# EAGLE schematic Servo_update (EAGLE 9.6.2)
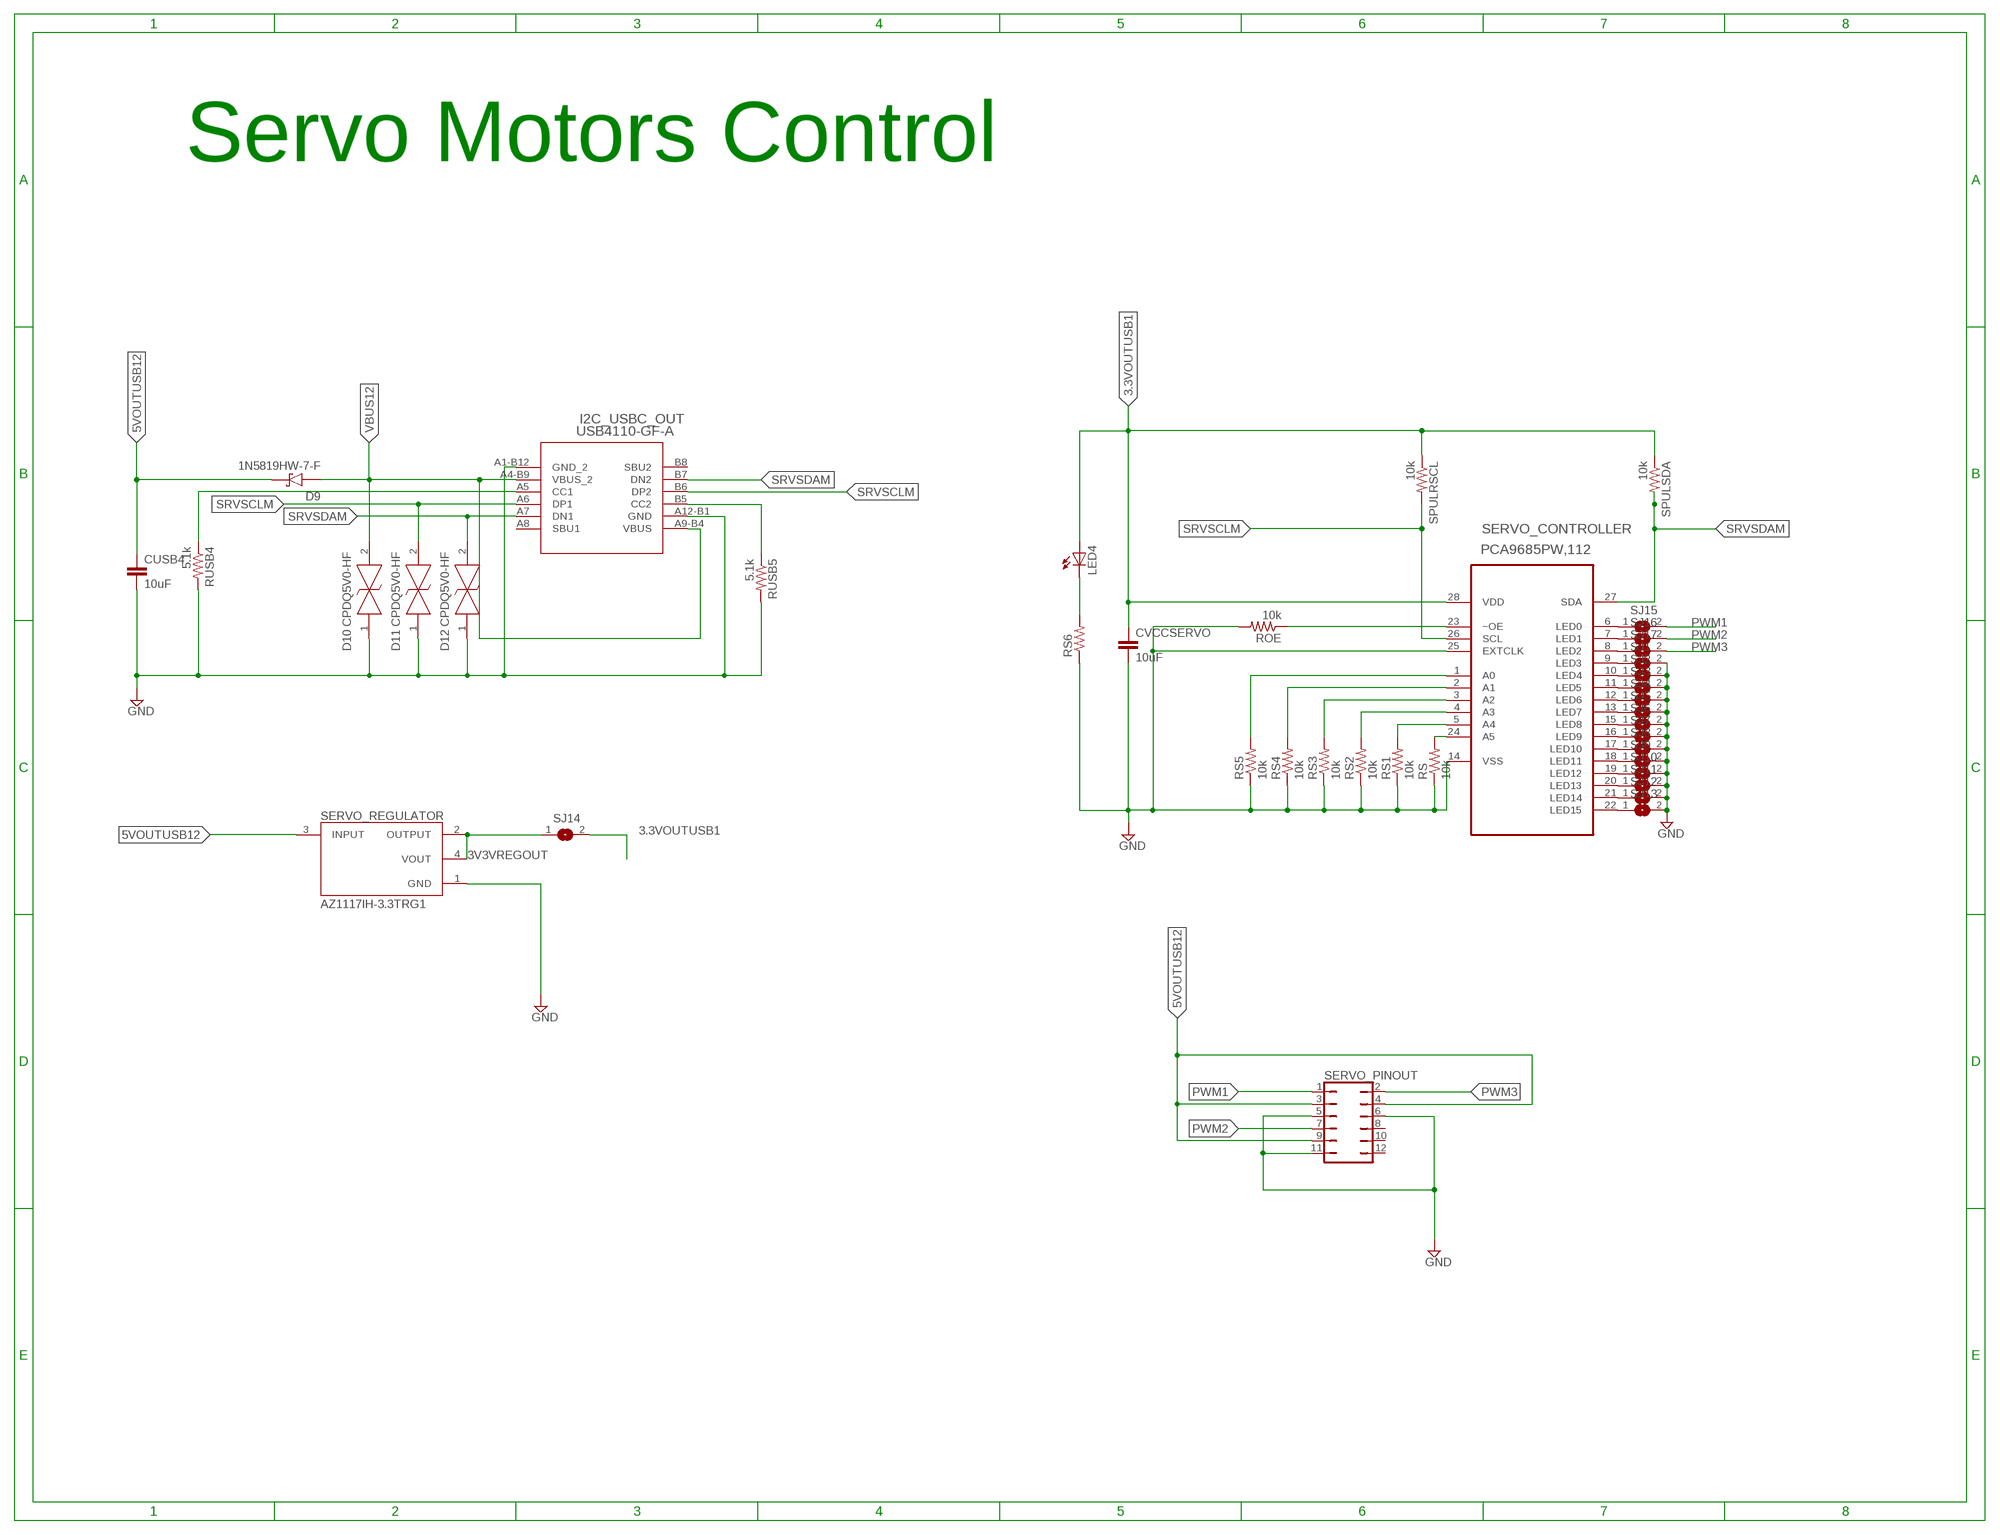
[diagram p0: schematic, sheet 1]

## Parts
CUSB4  10uF  C-EUC0805  [C0805]
CVCCSERVO  10uF  C-EUC0805  [C0805]
D9  1N5819HW-7-F  [SOD3715X145N]
D10  CPDQ5V0-HF  [MBTB-D-SOD-923F-IMP-0402]
D11  CPDQ5V0-HF  [MBTB-D-SOD-923F-IMP-0402]
D12  CPDQ5V0-HF  [MBTB-D-SOD-923F-IMP-0402]
I2C_USBC_OUT  USB4110-GF-A  [USB4110-GF-A_GCT]
LED4  LED  [SMARTLED-TTW]
ROE  10k  R-US_M0805  [M0805]
RS  10k  R-US_R0805  [R0805]
RS1  10k  R-US_R0805  [R0805]
RS2  10k  R-US_R0805  [R0805]
RS3  10k  R-US_R0805  [R0805]
RS4  10k  R-US_R0805  [R0805]
RS5  10k  R-US_R0805  [R0805]
RS6  2.2k  R-US_R0805  [R0805]
RUSB4  5.1k  R-US_M0805  [M0805]
RUSB5  5.1k  R-US_M0805  [M0805]
SERVO_CONTROLLER  PCA9685PW,112  [SOP65P640X110-28N]
SERVO_PINOUT  JP6Q  [JP6Q]
SERVO_REGULATOR  AZ1117IH-3.3TRG1  [SOT230P700X185-4N]
SJ1  SJ  [SJ]
SJ2  SJ  [SJ]
SJ3  SJ  [SJ]
SJ4  SJ  [SJ]
SJ5  SJ  [SJ]
SJ6  SJ  [SJ]
SJ7  SJ  [SJ]
SJ8  SJ  [SJ]
SJ9  SJ  [SJ]
SJ10  SJ  [SJ]
SJ11  SJ  [SJ]
SJ12  SJ  [SJ]
SJ13  SJ  [SJ]
SJ14  SJ  [SJ]
SJ15  SJ  [SJ]
SJ16  SJ  [SJ]
SJ17  SJ  [SJ]
SPULRSCL  10k  R-US_M0805  [M0805]
SPULSDA  10k  R-US_M0805  [M0805]

## Nets
3.3VOUTUSB1: CVCCSERVO.1 LED4.A@1(A) SERVO_CONTROLLER.28(VDD) SJ14.2 SPULRSCL.1 SPULSDA.1
3V3VREGOUT: SERVO_REGULATOR.2(OUTPUT) SERVO_REGULATOR.4(VOUT) SJ14.1
5VOUTUSB12: CUSB4.1 D9.C(K) SERVO_PINOUT.3 SERVO_PINOUT.4 SERVO_PINOUT.9 SERVO_REGULATOR.3(INPUT)
A0: RS5.2 SERVO_CONTROLLER.1(A0)
A1: RS4.2 SERVO_CONTROLLER.2(A1)
A2: RS3.2 SERVO_CONTROLLER.3(A2)
A3: RS2.2 SERVO_CONTROLLER.4(A3)
A4: RS1.2 SERVO_CONTROLLER.5(A4)
A5: RS.2 SERVO_CONTROLLER.24(A5)
CC1_RUSB4: I2C_USBC_OUT.A5(CC1) RUSB4.1
CC2: I2C_USBC_OUT.B5(CC2) RUSB5.1
GND: CUSB4.2 CVCCSERVO.2 D10.1(K) D11.1(K) D12.1(K) I2C_USBC_OUT.A1-B12(GND_2) I2C_USBC_OUT.A12-B1(GND) ROE.2 RS1.1 RS2.1 RS3.1 RS4.1 RS5.1 RS6.1 RS.1 RUSB4.2 RUSB5.2 SERVO_CONTROLLER.14(VSS) SERVO_CONTROLLER.25(EXTCLK) SERVO_PINOUT.5 SERVO_PINOUT.6 SERVO_PINOUT.11 SERVO_REGULATOR.1(GND) SJ1.2 SJ2.2 SJ3.2 SJ4.2 SJ5.2 SJ6.2 SJ7.2 SJ8.2 SJ9.2 SJ10.2 SJ11.2 SJ12.2 SJ13.2
LED_RS6: LED4.C@1(C) RS6.2
N$1: SERVO_CONTROLLER.9(LED3) SJ1.1
N$2: SERVO_CONTROLLER.10(LED4) SJ2.1
N$3: SERVO_CONTROLLER.11(LED5) SJ3.1
N$4: SERVO_CONTROLLER.12(LED6) SJ4.1
N$5: SERVO_CONTROLLER.13(LED7) SJ5.1
N$6: SERVO_CONTROLLER.15(LED8) SJ6.1
N$7: SERVO_CONTROLLER.16(LED9) SJ7.1
N$8: SERVO_CONTROLLER.18(LED11) SJ9.1
N$9: SERVO_CONTROLLER.19(LED12) SJ10.1
N$10: SERVO_CONTROLLER.20(LED13) SJ11.1
N$11: SERVO_CONTROLLER.21(LED14) SJ12.1
N$12: SERVO_CONTROLLER.17(LED10) SJ8.1
N$13: SERVO_CONTROLLER.22(LED15) SJ13.1
N$14: SERVO_CONTROLLER.6(LED0) SJ15.1
N$15: SERVO_CONTROLLER.7(LED1) SJ16.1
N$16: SERVO_CONTROLLER.8(LED2) SJ17.1
OE: ROE.1 SERVO_CONTROLLER.23(~OE)
PWM1: SERVO_PINOUT.1 SJ15.2
PWM2: SERVO_PINOUT.7 SJ16.2
PWM3: SERVO_PINOUT.2 SJ17.2
SRVSCLM: D11.2(A) I2C_USBC_OUT.A6(DP1) I2C_USBC_OUT.B6(DP2) SERVO_CONTROLLER.26(SCL) SPULRSCL.2
SRVSDAM: D12.2(A) I2C_USBC_OUT.A7(DN1) I2C_USBC_OUT.B7(DN2) SERVO_CONTROLLER.27(SDA) SPULSDA.2
VBUS12: D9.A D10.2(A) I2C_USBC_OUT.A4-B9(VBUS_2) I2C_USBC_OUT.A9-B4(VBUS)
Unconnected: I2C_USBC_OUT.A8(SBU1) I2C_USBC_OUT.B8(SBU2) SERVO_PINOUT.8 SERVO_PINOUT.10 SERVO_PINOUT.12

## Notes on the sheet
- Servo Motors Control

## Library data of the parts
CUSB4 CVCCSERVO = rcl:C-EU: CAPACITOR, European symbol; SPICEPREFIX: C
D9 = 1N5819HW-7-F:1N5819HW-7-F: 1N5819HW Series 40 V 1 A Surface Mount Schottky Barrier Rectifier - SOD-123 Check availability <https://pricing.snapeda.com/parts/1N5819HW-7-F/Diodes%20Inc./view-part?ref=eda>; AVAILABILITY: In Stock; CHECK_PRICES: https://www.snapeda.com/parts/1N5819HW-7-F/Diodes+Inc./view-part/?ref=eda; DESCRIPTION: Diode Schottky 1A 40V SOD123 | Diodes Inc 1N5819HW-7-F; MF: Diodes Inc.; MP: 1N5819HW-7-F; PACKAGE: SOD-123 Fairchild Semiconductor; PRICE: None; PURCHASE-URL: https://www.snapeda.com/api/url_track_click_mouser/?unipart_id=42272&manufacturer=Diodes Inc.&part_name=1N5819HW-7-F&search_term=1n5819hw-7-f; SNAPEDA_LINK: https://www.snapeda.com/parts/1N5819HW-7-F/Diodes+Inc./view-part/?ref=snap
D10-D12 = CPDQ5V0-HF:CPDQ5V0-HF: ESD Suppressors / TVS Diodes SMD ESD Diode 5V Bi-Direction Source: Datasheet <https://componentsearchengine.com/Datasheets/1/CPDQ5V0-HF.pdf> Check availability <https://pricing.snapeda.com/parts/CPDQ5V0-HF/Comchip%20Technology/view-part?ref=eda>; AVAILABILITY: In Stock; CHECK_PRICES: https://www.snapeda.com/parts/CPDQ5V0-HF/Comchip+Technology/view-part/?ref=eda; DESCRIPTION: 18.6V Clamp 9.4A (8/20µs) Ipp Tvs Diode Surface Mount 0402/SOD-923F; MF: Comchip Technology; MP: CPDQ5V0-HF; PACKAGE: 0402 Comchip; PRICE: None; PURCHASE-URL: https://www.snapeda.com/api/url_track_click_mouser/?unipart_id=809934&manufacturer=Comchip Technology&part_name=CPDQ5V0-HF&search_term=cpdq5v0-hf; SNAPEDA_LINK: https://www.snapeda.com/parts/CPDQ5V0-HF/Comchip+Technology/view-part/?ref=snap
I2C_USBC_OUT = USB4110-GF-A:USB4110-GF-A; COPYRIGHT: Copyright (C) 2023 Ultra Librarian. All rights reserved.; MANUFACTURER_PART_NUMBER: USB4110-GF-A; MFR_NAME: Global Connector Technology
LED4 = adafruit:LED: LED OSRAM: - CHIPLED LG R971, LG N971, LY N971, LG Q971, LY Q971, LO R971, LY R971 LH N974, LH R974 LS Q976, LO Q976, LY Q976 LO Q996 - Hyper CHIPLED LW Q18S LB Q993, LB Q99A, LB R99A - SideLED LS A670, LO A670, LY A670, LG A670, LP A670 LB A673, LV A673, LT A673, LW A673 LH A674 LY A675 LS A676, LA A676, LO A676, LY A676, LW A676 LS A679, LY A679, LG A679 - Hyper Micro SIDELED® LS Y876, LA Y876, LO Y876, LY Y876 LT Y87S - SmartLED LW L88C, LW L88S LB L89C, LB L89S, LG L890 LS L89K, LO L89K, LY L89K LS L896, LA L896, LO L896, LY L896 - TOPLED LS T670, LO T670, LY T670, LG T670, LP T670 LSG T670, LSP T670, LSY T670, LOP T670, LYG T670 LG T671, LOG T671, LSG T671 LB T673, LV T673, LT T673, LW T673 LH T674 LS T676, LA T676, LO T676, LY T676, LB T676, LH T676, LSB T676, LW T676 LB T67C, LV T67C, LT T67C, LS T67K, LO T67K, LY T67K, LW E67C LS E67B, LA E67B, LO E67B, LY E67B, LB E67C, LV E67C, LT E67C LW T67C LS T679, LY T679, LG T679 LS T770, LO T770, LY T770, LG T770, LP T770 LB T773, LV T773, LT T773, LW T773 LH T774 LS E675, LA E675, LY E675, LS T675 LS T776, LA T776, LO T776, LY T776, LB T776 LHGB T686 LT T68C, LB T68C - Hyper Mini TOPLED® LB M676 - Mini TOPLED Santana® LG M470 LS M47K, LO M47K, LY M47K Source: http://www.osram.convergy.de/
ROE RS RS1-RS6 RUSB4 RUSB5 SPULRSCL SPULSDA = rcl:R-US_: RESISTOR, American symbol; SPICEPREFIX: R
SERVO_CONTROLLER = PCA9685PW_112:PCA9685PW,112: 16-channel, 12-bit PWM Fm+ I2C-bus LED controller Check availability <https://pricing.snapeda.com/parts/PCA9685PW%2C112/NXP%20USA/view-part?ref=eda>; AVAILABILITY: In Stock; CHECK_PRICES: https://www.snapeda.com/parts/PCA9685PW,112/NXP+USA+Inc./view-part/?ref=eda; DESCRIPTION: LED Driver IC 16 Output Linear - PWM Dimming 25mA 28-TSSOP; MF: NXP USA; MP: PCA9685PW,112; PACKAGE: TSSOP-28 NXP Semiconductors; PRICE: None; PURCHASE-URL: https://pricing.snapeda.com/search?q=PCA9685PW,112&ref=eda; SNAPEDA_LINK: https://www.snapeda.com/parts/PCA9685PW,112/NXP+USA+Inc./view-part/?ref=snap
SERVO_PINOUT = jumper:JP6Q: JUMPER
SERVO_REGULATOR = AZ1117IH-3.3TRG1:AZ1117IH-3.3TRG1: Check availability <https://pricing.snapeda.com/parts/AZ1117IH-3.3TRG1/Diodes%20Inc./view-part?ref=eda>; AVAILABILITY: In Stock; CHECK_PRICES: https://www.snapeda.com/parts/AZ1117IH-3.3TRG1/Diodes+Inc./view-part/?ref=eda; DESCRIPTION: Linear Voltage Regulator IC Positive Fixed 1 Output 1A SOT-223-3; MF: Diodes Inc.; MP: AZ1117IH-3.3TRG1; PACKAGE: SOT-223 Diodes Inc.; PRICE: None; PURCHASE-URL: https://www.snapeda.com/api/url_track_click_mouser/?unipart_id=490259&manufacturer=Diodes Inc.&part_name=AZ1117IH-3.3TRG1&search_term=az1117ih-3.3trg1; SNAPEDA_LINK: https://www.snapeda.com/parts/AZ1117IH-3.3TRG1/Diodes+Inc./view-part/?ref=snap
SJ1-SJ17 = jumper:SJ: SMD solder JUMPER